# Altium schematic sheet pedal.SchDoc
size A
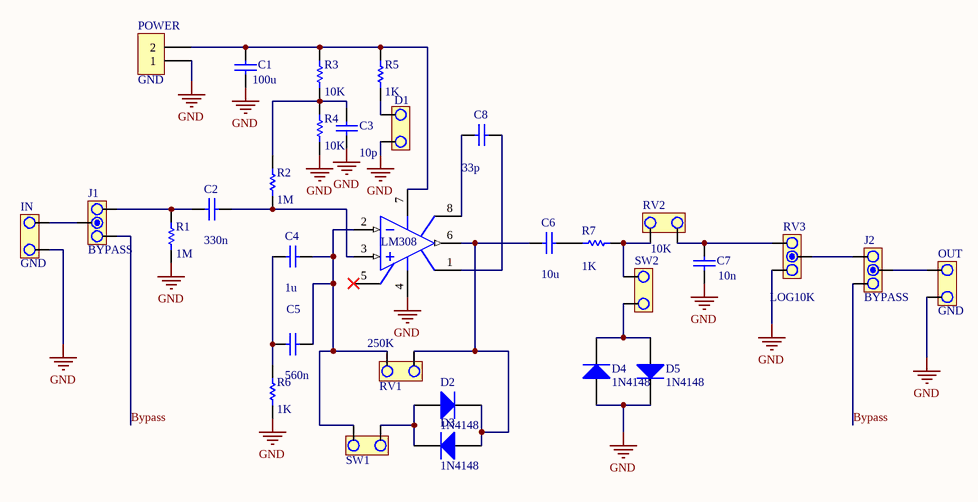
[diagram p0: pedal.SchDoc]

## Parts
C1  value 100u  [CAP200]
C2  value 330n  [CAP200]
C3  value 10p  [CAP200]
C4  value 1u  [CAP200]
C5  value 560n  [RAD-0.3]
C6  value 10u  [CAP200]
C7  value 10n  [CAP200]
C8  value 33p  [CAP200]
D1  (no value)  [JUMPER2]
D2  1N4148  [DO-35]
D3  1N4148  [DO-35]
D4  1N4148  [DO-35]
D5  1N4148  [DO-35]
IN  GND  [JUMPER2]
J1  BYPASS  [JUMPER3]
J2  BYPASS  [JUMPER3]
LM308  (no value)  [DIP8]
OUT  GND  [JUMPER2]
POWER  GND  [BORNERA2]
R1  value 1M  [AXIAL-0.3]
R2  value 1M  [AXIAL-0.3]
R3  value 10K  [AXIAL-0.3]
R4  value 10K  [AXIAL-0.3]
R5  value 1K  [AXIAL-0.3]
R6  value 1K  [AXIAL-0.3]
R7  value 1K  [AXIAL-0.3]
RV1  value 250K  [JUMPER2]
RV2  value 10K  [JUMPER2]
RV3  value LOG10K  [JUMPER3]
SW1  (no value)  [JUMPER2]
SW2  (no value)  [JUMPER2]

## Nets
GND: C1.1 C3.1 C7.1 D1.1 D4.1(A) D5.2(K) IN.2 LM308.4(V-) OUT.1 POWER.1 R1.1 R4.1 R6.1 RV3.1
Bypass: J1.3 J2.1
NetC1_2: C1.2 LM308.7(V+) POWER.2 R3.2 R5.2
NetC2_1: C2.1 J1.1 R1.2
NetC2_2: C2.2 LM308.3(IN+) R2.1
NetC3_2: C3.2 R2.2 R3.1 R4.2
NetC4_1: C4.1 C5.1 R6.2
NetC4_2: C4.2 C5.2 LM308.2(IN-) RV1.1 SW1.1
NetC6_1: C6.1 D2.2(K) D3.1(A) LM308.6(OUT) RV1.2
NetC6_2: C6.2 R7.1
NetC7_2: C7.2 RV2.1 RV3.3
NetC8_1: C8.1 LM308.8(TAB)
NetC8_2: C8.2 LM308.1(OS_NUL)
NetD1_2: D1.2 R5.1
NetD2_1: D2.1(A) D3.2(K) SW1.2
NetD4_2: D4.2(K) D5.1(A) SW2.1
NetIN_1: IN.1 J1.2
NetJ2_2: J2.2 OUT.2
NetJ2_3: J2.3 RV3.2
NetR7_2: R7.2 RV2.2 SW2.2

Not connected (* = marked no-connect by the designer): LM308 5(OS_NUL)*

## Library data of the parts
C1-C7 = Cap: Capacitor; Published: 8-Jun-2000; LatestRevisionDate: 17-Jul-2002; LatestRevisionNote: Re-released for DXP Platform.; PackageReference: RAD-0.3; Publisher: Altium Limited; PackageDescription: Radial Cap, Thru-Hole; 2 Leads; 0.3 in Pin Spacing
C8 = Cap: Published: 8-Jun-2000; LatestRevisionDate: 17-Jul-2002; LatestRevisionNote: Re-released for DXP Platform.; PackageReference: RAD-0.3; Publisher: Altium Limited; PackageDescription: Radial Cap, Thru-Hole; 2 Leads; 0.3 in Pin Spacing
D1 IN OUT RV1 RV2 SW1 SW2 = JUMPER
D2-D5 = Diode 1N4148: High Conductance Fast Diode; Published: 8-Jun-2000; LatestRevisionDate: 17-Jul-2002; LatestRevisionNote: Re-released for DXP Platform.; DatasheetVersion: 1997; PackageReference: DO-35; Publisher: Altium Limited; PackageDescription: Diode, Axial; Body 3.8 x 1.9 mm (LxDia. max), Lead Dia. 0.53 mm (max); Code_JEDEC: DO-204-AH; ComponentLink1Description: Manufacturer Link; ComponentLink1URL: http://www.fairchildsemi.com/; ComponentLink2Description: Datasheet; ComponentLink2URL: http://www.fairchildsemi.com/ds/1N%2F1N4148.pdf
J1 J2 RV3 = JUMPER3
LM308 = Op Amp: FET Operational Amplifier; Published: 8-Jun-2000; LatestRevisionDate: 17-Jul-2002; LatestRevisionNote: Re-released for DXP Platform.; DatasheetVersion: REV. B; PackageVersion: 1990; PackageReference: H-08A; Publisher: Altium Limited; PackageDescription: Can; 8 Leads; Pin Circle Dia. 5.08 mm; Lead Dia. 0.53 mm (max); ComponentLink1Description: Manufacturer Link; ComponentLink1URL: http://www.analog.com/
POWER = BORNERA 2
R1-R7 = Res1: Resistor; Published: 8-Jun-2000; LatestRevisionDate: 17-Jul-2002; LatestRevisionNote: Re-released for DXP Platform.; PackageReference: AXIAL-0.3; Publisher: Altium Limited; PackageDescription: Axial Device, Thru-Hole; 2 Leads; 0.3 in Pin Spacing